# Altium project SixDOFManipulatorControllerWithRaspberryPiPicoInArduino.PrjPcb
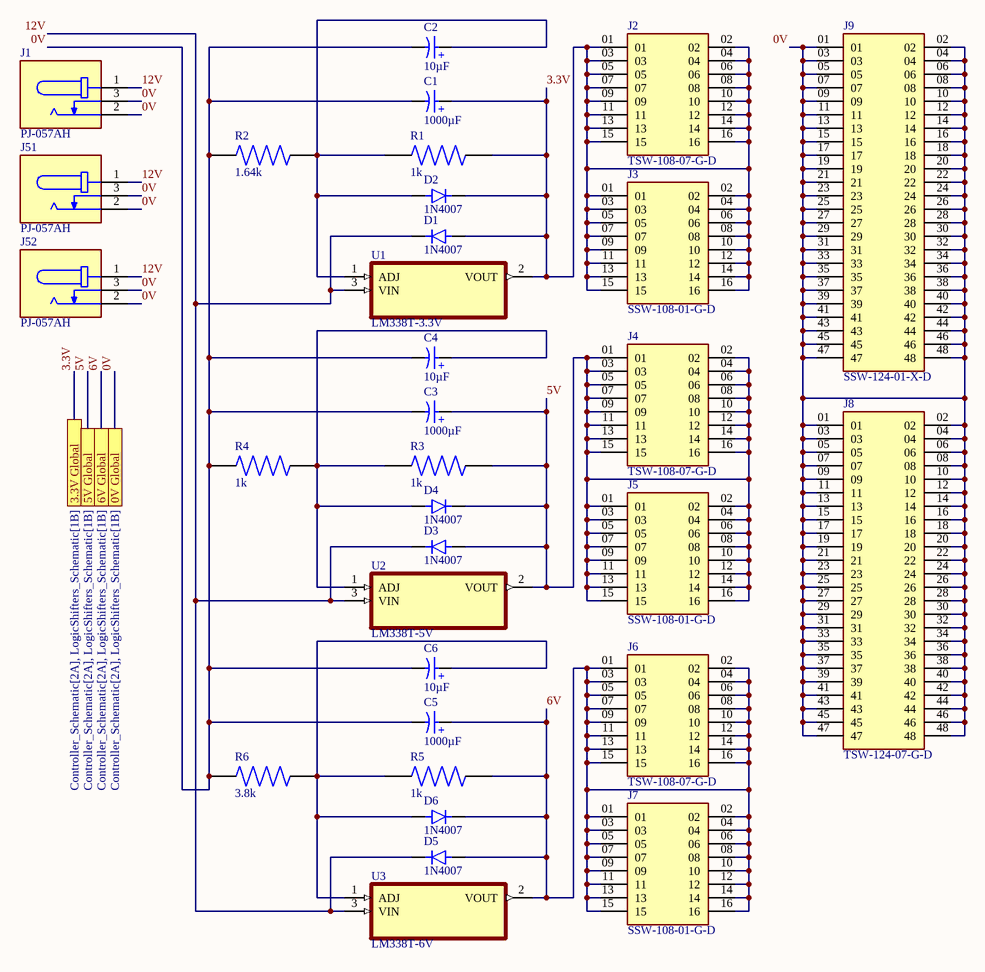
[diagram p0: PowerSupply_Schematic.SchDoc]
3 sheets, 135 parts. Net scope: flat (ports and power ports of the same name join across sheets).
Board file: PCB.PcbDoc
Sheets:
  PowerSupply_Schematic.SchDoc
  LogicShifters_Schematic.SchDoc
  Controller_Schematic.SchDoc

## Sheet PowerSupply_Schematic.SchDoc
size A3; SheetNumber: 1; SheetTotal: 3; SPICEModelCacheCBIUOFXF: <root> / <DocumentId>CBIUOFXF</DocumentId> / <CacheFrame Number="0"> / <Model Name="860020375017_1mf" Kind="CKT"> / <Text>******* / .subckt 860020375017_1mF 1 2 / Rser 1 3 0.071 / Lser 2 4 0.0000000243 / C1 3 4 0.001 / Rpar 3 4 100000 / .ends 860020375017_1mF</Text> / </Model> / <Model Name="860020372001_10uf" Kind="CKT"> / <Text>******* / .subckt 860020372001_10uF 1 2 / Rser 1 3 1.95182658193 / Lser 2 4 4.159236184E-09 / C1 3 4 0.00001 / Rpar 3 4 5333333.33333333 / .ends 860020372001_10uF</Text> / </Model> / </CacheFrame> / </root>

### Parts
C1  1000µF  [WCAP-ATG5_D10H12.5]
C2  10µF  [WCAP-ATG5_D5H11]
C3  1000µF  [WCAP-ATG5_D10H12.5]
C4  10µF  [WCAP-ATG5_D5H11]
C5  1000µF  [WCAP-ATG5_D10H12.5]
C6  10µF  [WCAP-ATG5_D5H11]
D1  1N4007  [DIOAD1060W80L520D270]
D2  1N4007  [DIOAD1060W80L520D270]
D3  1N4007  [DIOAD1060W80L520D270]
D4  1N4007  [DIOAD1060W80L520D270]
D5  1N4007  [DIOAD1060W80L520D270]
D6  1N4007  [DIOAD1060W80L520D270]
J1  PJ-057AH  [CUI_PJ-057AH]
J2  TSW-108-07-G-D  [SAMTEC_TSW-108-07-G-D]
J3  SSW-108-01-G-D  [SAMTEC_SSW-108-01-G-D]
J4  TSW-108-07-G-D  [SAMTEC_TSW-108-07-G-D]
J5  SSW-108-01-G-D  [SAMTEC_SSW-108-01-G-D]
J6  TSW-108-07-G-D  [SAMTEC_TSW-108-07-G-D]
J7  SSW-108-01-G-D  [SAMTEC_SSW-108-01-G-D]
J8  TSW-124-07-G-D  [SAMTEC_TSW-124-07-G-D]
J9  SSW-124-01-X-D  [SAMTEC_SSW-124-01-X-D]
J51  PJ-057AH  [CUI_PJ-057AH]
J52  PJ-057AH  [CUI_PJ-057AH]
R1  1k  [RESAD700W45L350D185]
R2  1.64k  [RESAD700W45L350D185]
R3  1k  [RESAD700W45L350D185]
R4  1k  [RESAD700W45L350D185]
R5  1k  [RESAD700W45L350D185]
R6  3.8k  [RESAD700W45L350D185]
U1  LM338T-3.3V  [TO254P1054X470X1955-3]
U2  LM338T-5V  [TO254P1054X470X1955-3]
U3  LM338T-6V  [TO254P1054X470X1955-3]

### Ports
0V Global (see Controller_Schematic[2A], LogicShifters_Schematic[1B]), 3.3V Global (see Controller_Schematic[2A], LogicShifters_Schematic[1B]), 5V Global (see Controller_Schematic[2A], LogicShifters_Schematic[1B]), 6V Global (see Controller_Schematic[2A], LogicShifters_Schematic[1B])

### Nets
0V: C1.2(N) C2.2(N) C3.2(N) C4.2(N) C5.2(N) C6.2(N) J1.2 J1.3 J8.01 J8.02 J8.03 J8.04 J8.05 J8.06 J8.07 J8.08 J8.09 J8.10 J8.11 J8.12 J8.13 J8.14 J8.15 J8.16 J8.17 J8.18 J8.19 J8.20 J8.21 J8.22 J8.23 J8.24 J8.25 J8.26 J8.27 J8.28 J8.29 J8.30 J8.31 J8.32 J8.33 J8.34 J8.35 J8.36 J8.37 J8.38 J8.39 J8.40 J8.41 J8.42 J8.43 J8.44 J8.45 J8.46 J8.47 J8.48 J9.01 J9.02 J9.03 J9.04 J9.05 J9.06 J9.07 J9.08 J9.09 J9.10 J9.11 J9.12 J9.13 J9.14 J9.15 J9.16 J9.17 J9.18 J9.19 J9.20 J9.21 J9.22 J9.23 J9.24 J9.25 J9.26 J9.27 J9.28 J9.29 J9.30 J9.31 J9.32 J9.33 J9.34 J9.35 J9.36 J9.37 J9.38 J9.39 J9.40 J9.41 J9.42 J9.43 J9.44 J9.45 J9.46 J9.47 J9.48 J51.2 J51.3 J52.2 J52.3 R2.1 R4.1 R6.1 ; port 0V Global
3.3V: C1.1(P) D1.A D2.C J2.01 J2.02 J2.03 J2.04 J2.05 J2.06 J2.07 J2.08 J2.09 J2.10 J2.11 J2.12 J2.13 J2.14 J2.15 J2.16 J3.01 J3.02 J3.03 J3.04 J3.05 J3.06 J3.07 J3.08 J3.09 J3.10 J3.11 J3.12 J3.13 J3.14 J3.15 J3.16 R1.2 U1.2(VOUT) ; port 3.3V Global
5V: C3.1(P) D3.A D4.C J4.01 J4.02 J4.03 J4.04 J4.05 J4.06 J4.07 J4.08 J4.09 J4.10 J4.11 J4.12 J4.13 J4.14 J4.15 J4.16 J5.01 J5.02 J5.03 J5.04 J5.05 J5.06 J5.07 J5.08 J5.09 J5.10 J5.11 J5.12 J5.13 J5.14 J5.15 J5.16 R3.2 U2.2(VOUT) ; port 5V Global
6V: C5.1(P) D5.A D6.C J6.01 J6.02 J6.03 J6.04 J6.05 J6.06 J6.07 J6.08 J6.09 J6.10 J6.11 J6.12 J6.13 J6.14 J6.15 J6.16 J7.01 J7.02 J7.03 J7.04 J7.05 J7.06 J7.07 J7.08 J7.09 J7.10 J7.11 J7.12 J7.13 J7.14 J7.15 J7.16 R5.2 U3.2(VOUT) ; port 6V Global
12V: D1.C D3.C D5.C J1.1 J51.1 J52.1 U1.3(VIN) U2.3(VIN) U3.3(VIN)
NetC2_1: C2.1(P) D2.A R1.1 R2.2 U1.1(ADJ)
NetC4_1: C4.1(P) D4.A R3.1 R4.2 U2.1(ADJ)
NetC6_1: C6.1(P) D6.A R5.1 R6.2 U3.1(ADJ)

### Notes on the sheet
- (in symbol 860020372001) +
- (in symbol 860020375017) +

### Library data of the parts
C1 C3 C5 = 860020375017: WCAP-ATG5 Aluminum Electrolytic Capacitor, Radial, THT, D10 x H12.5mm, 1000µF, 16V; Manufacturer: Wurth Elektronik; Capacitance Tolerance: +/-20%; Dissipation Factor: 15%; Endurance: 2000h; Leakage Current: 160µA; Ripple Current: 540mA; Technical Reference: ATDF125102M016DSPA9B000; Manufacturer Part Number: 860020375017; Category: Aluminum Electrolytic Capacitors; Match Code: WCAP-ATG5; ComponentLink1Description: Website Link; ComponentLink1URL: https://www.we-online.com/redexpert/article/860020375017?ad; ComponentLink2Description: Datasheet Link; ComponentLink2URL: https://www.we-online.com/redexpert/spec/860020375017?ad; Mount: Through Hole; Operating Temperature Max: 105°C; Operating Temperature Min: -40°C; Packaging: Ammo Pack; Height: 12.5mm; Diameter: 10mm; Capacitance: 1000µF; Rated Voltage (DC): 16V
C2 C4 C6 = 860020372001: WCAP-ATG5 Aluminum Electrolytic Capacitor, Radial, THT, D5 x H11mm, 10µF, 16V; Manufacturer: Wurth Elektronik; Capacitance Tolerance: +/-20%; Dissipation Factor: 15%; Endurance: 2000h; Leakage Current: 3µA; Ripple Current: 35mA; Technical Reference: ATDC110100M016DSPA3B000; Manufacturer Part Number: 860020372001; Category: Aluminum Electrolytic Capacitors; Match Code: WCAP-ATG5; ComponentLink1Description: Website Link; ComponentLink1URL: https://www.we-online.com/redexpert/article/860020372001?ad; ComponentLink2Description: Datasheet Link; ComponentLink2URL: https://www.we-online.com/redexpert/spec/860020372001?ad; Mount: Through Hole; Operating Temperature Max: 105°C; Operating Temperature Min: -40°C; Packaging: Ammo Pack; Height: 11mm; Diameter: 5mm; Capacitance: 10µF; Rated Voltage (DC): 16V
D1-D6 = 1N4007: Rectifier Silicon, 1000V, 1 A, DO-41 Case, Solder Leads, 1N Series | NTE Electronics Inc. 1N4007; MF: NTE Electronics, Inc.; SnapEDA_Link: https://www.snapeda.com/parts/1N4007/NTE+Electronics/view-part/?ref=snap; Package: DO-41 NTE Electronics; Value: *; MP: 1N4007; Check_prices: https://www.snapeda.com/parts/1N4007/NTE+Electronics/view-part/?ref=eda
J1 J51 J52 = PJ-057AH: 2.0 x 6.3 mm, 5.0 A, Horizontal, Through Hole, Pick-n-Place Top, Dc Power Jack Connector; MF: Same Sky; SnapEDA_Link: https://www.snapeda.com/parts/PJ-057AH/Same+Sky/view-part/?ref=snap; Package: None; Value: *; MP: PJ-057AH; Check_prices: https://www.snapeda.com/parts/PJ-057AH/Same+Sky/view-part/?ref=eda
J2 J4 J6 = TSW-108-07-G-D: MF: Samtec; MP: TSW-108-07-G-D; Price: None; Package: None; Value: *; Availability: Unavailable
J3 J5 J7 = SSW-108-01-G-D: MF: Samtec; Package: None; Price: None; Value: *; MP: SSW-108-01-G-D; Availability: Unavailable
J8 = TSW-124-07-G-D: MF: Samtec; Price: None; Value: *; MP: TSW-124-07-G-D; Package: None; Availability: Unavailable
J9 = SSW-124-01-X-D: MF: Samtec; Package: None; Price: None; Value: *; MP: SSW-124-01-X-D; Availability: Unavailable
R1-R6 = 3-1623927-1: 1 MOhms Â±5% 0.25W, 1/4W Through Hole Resistor Axial - Carbon Film; MF: TE Connectivity; SnapEDA_Link: https://www.snapeda.com/parts/3-1623927-1/TE+Connectivity/view-part/?ref=snap; Package: None; Value: *; MP: 3-1623927-1; Check_prices: https://www.snapeda.com/parts/3-1623927-1/TE+Connectivity/view-part/?ref=eda
U1-U3 = LM338T: 5-A, 40-V, low-IQ, adjustable linear voltage regulator 3-TO-220 0 to 125; MF: Texas Instruments; SnapEDA_Link: https://www.snapeda.com/parts/LM338T/Texas+Instruments/view-part/?ref=snap; Package: TO-220-3 Texas Instruments; Value: *; MP: LM338T; Check_prices: https://www.snapeda.com/parts/LM338T/Texas+Instruments/view-part/?ref=eda

## Sheet LogicShifters_Schematic.SchDoc
size A3; SheetNumber: 2; SheetTotal: 3
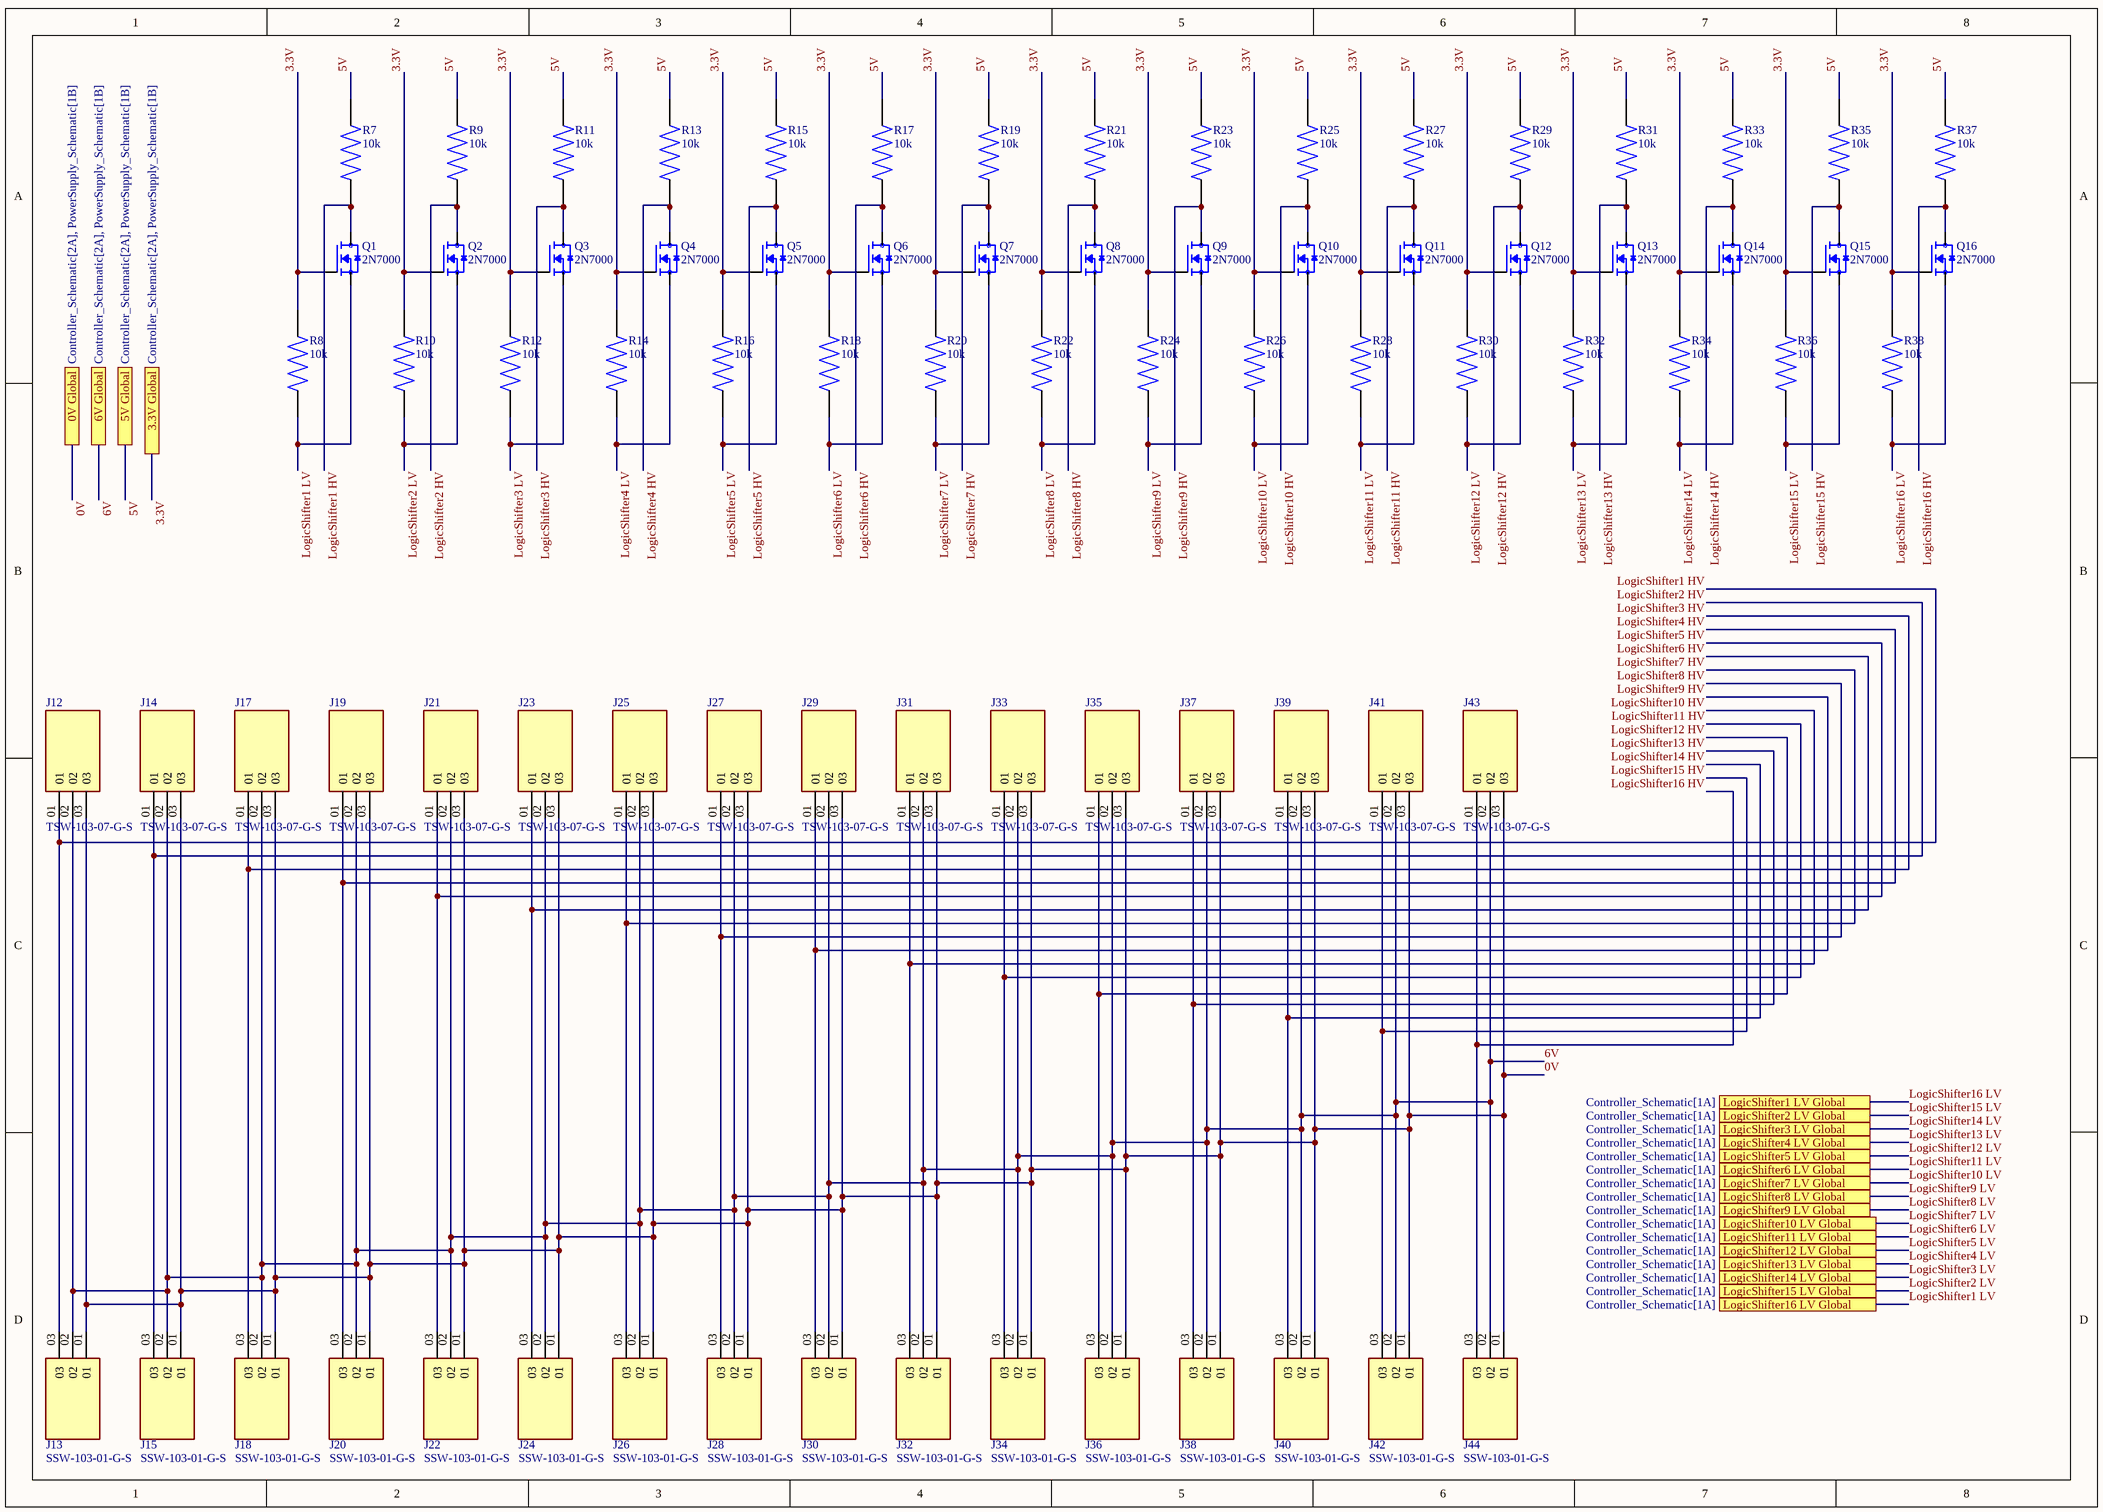
[diagram p1: LogicShifters_Schematic.SchDoc]

### Parts
J12  TSW-103-07-G-S  [SAMTEC_TSW-103-07-G-S]
J13  SSW-103-01-G-S  [SAMTEC_SSW-103-01-G-S]
J14  TSW-103-07-G-S  [SAMTEC_TSW-103-07-G-S]
J15  SSW-103-01-G-S  [SAMTEC_SSW-103-01-G-S]
J17  TSW-103-07-G-S  [SAMTEC_TSW-103-07-G-S]
J18  SSW-103-01-G-S  [SAMTEC_SSW-103-01-G-S]
J19  TSW-103-07-G-S  [SAMTEC_TSW-103-07-G-S]
J20  SSW-103-01-G-S  [SAMTEC_SSW-103-01-G-S]
J21  TSW-103-07-G-S  [SAMTEC_TSW-103-07-G-S]
J22  SSW-103-01-G-S  [SAMTEC_SSW-103-01-G-S]
J23  TSW-103-07-G-S  [SAMTEC_TSW-103-07-G-S]
J24  SSW-103-01-G-S  [SAMTEC_SSW-103-01-G-S]
J25  TSW-103-07-G-S  [SAMTEC_TSW-103-07-G-S]
J26  SSW-103-01-G-S  [SAMTEC_SSW-103-01-G-S]
J27  TSW-103-07-G-S  [SAMTEC_TSW-103-07-G-S]
J28  SSW-103-01-G-S  [SAMTEC_SSW-103-01-G-S]
J29  TSW-103-07-G-S  [SAMTEC_TSW-103-07-G-S]
J30  SSW-103-01-G-S  [SAMTEC_SSW-103-01-G-S]
J31  TSW-103-07-G-S  [SAMTEC_TSW-103-07-G-S]
J32  SSW-103-01-G-S  [SAMTEC_SSW-103-01-G-S]
J33  TSW-103-07-G-S  [SAMTEC_TSW-103-07-G-S]
J34  SSW-103-01-G-S  [SAMTEC_SSW-103-01-G-S]
J35  TSW-103-07-G-S  [SAMTEC_TSW-103-07-G-S]
J36  SSW-103-01-G-S  [SAMTEC_SSW-103-01-G-S]
J37  TSW-103-07-G-S  [SAMTEC_TSW-103-07-G-S]
J38  SSW-103-01-G-S  [SAMTEC_SSW-103-01-G-S]
J39  TSW-103-07-G-S  [SAMTEC_TSW-103-07-G-S]
J40  SSW-103-01-G-S  [SAMTEC_SSW-103-01-G-S]
J41  TSW-103-07-G-S  [SAMTEC_TSW-103-07-G-S]
J42  SSW-103-01-G-S  [SAMTEC_SSW-103-01-G-S]
J43  TSW-103-07-G-S  [SAMTEC_TSW-103-07-G-S]
J44  SSW-103-01-G-S  [SAMTEC_SSW-103-01-G-S]
Q1  2N7000  [TO92254P458H750-3]
Q2  2N7000  [TO92254P458H750-3]
Q3  2N7000  [TO92254P458H750-3]
Q4  2N7000  [TO92254P458H750-3]
Q5  2N7000  [TO92254P458H750-3]
Q6  2N7000  [TO92254P458H750-3]
Q7  2N7000  [TO92254P458H750-3]
Q8  2N7000  [TO92254P458H750-3]
Q9  2N7000  [TO92254P458H750-3]
Q10  2N7000  [TO92254P458H750-3]
Q11  2N7000  [TO92254P458H750-3]
Q12  2N7000  [TO92254P458H750-3]
Q13  2N7000  [TO92254P458H750-3]
Q14  2N7000  [TO92254P458H750-3]
Q15  2N7000  [TO92254P458H750-3]
Q16  2N7000  [TO92254P458H750-3]
R7  10k  [RESAD700W45L350D185]
R8  10k  [RESAD700W45L350D185]
R9  10k  [RESAD700W45L350D185]
R10  10k  [RESAD700W45L350D185]
R11  10k  [RESAD700W45L350D185]
R12  10k  [RESAD700W45L350D185]
R13  10k  [RESAD700W45L350D185]
R14  10k  [RESAD700W45L350D185]
R15  10k  [RESAD700W45L350D185]
R16  10k  [RESAD700W45L350D185]
R17  10k  [RESAD700W45L350D185]
R18  10k  [RESAD700W45L350D185]
R19  10k  [RESAD700W45L350D185]
R20  10k  [RESAD700W45L350D185]
R21  10k  [RESAD700W45L350D185]
R22  10k  [RESAD700W45L350D185]
R23  10k  [RESAD700W45L350D185]
R24  10k  [RESAD700W45L350D185]
R25  10k  [RESAD700W45L350D185]
R26  10k  [RESAD700W45L350D185]
R27  10k  [RESAD700W45L350D185]
R28  10k  [RESAD700W45L350D185]
R29  10k  [RESAD700W45L350D185]
R30  10k  [RESAD700W45L350D185]
R31  10k  [RESAD700W45L350D185]
R32  10k  [RESAD700W45L350D185]
R33  10k  [RESAD700W45L350D185]
R34  10k  [RESAD700W45L350D185]
R35  10k  [RESAD700W45L350D185]
R36  10k  [RESAD700W45L350D185]
R37  10k  [RESAD700W45L350D185]
R38  10k  [RESAD700W45L350D185]

### Ports
0V Global (see Controller_Schematic[2A], PowerSupply_Schematic[1B]), 3.3V Global (see Controller_Schematic[2A], PowerSupply_Schematic[1B]), 5V Global (see Controller_Schematic[2A], PowerSupply_Schematic[1B]), 6V Global (see Controller_Schematic[2A], PowerSupply_Schematic[1B]), LogicShifter1 LV Global (see Controller_Schematic[1A]), LogicShifter2 LV Global (see Controller_Schematic[1A]), LogicShifter3 LV Global (see Controller_Schematic[1A]), LogicShifter4 LV Global (see Controller_Schematic[1A]), LogicShifter5 LV Global (see Controller_Schematic[1A]), LogicShifter6 LV Global (see Controller_Schematic[1A]), LogicShifter7 LV Global (see Controller_Schematic[1A]), LogicShifter8 LV Global (see Controller_Schematic[1A]), LogicShifter9 LV Global (see Controller_Schematic[1A]), LogicShifter10 LV Global (see Controller_Schematic[1A]), LogicShifter11 LV Global (see Controller_Schematic[1A]), LogicShifter12 LV Global (see Controller_Schematic[1A]), LogicShifter13 LV Global (see Controller_Schematic[1A]), LogicShifter14 LV Global (see Controller_Schematic[1A]), LogicShifter15 LV Global (see Controller_Schematic[1A]), LogicShifter16 LV Global (see Controller_Schematic[1A])

### Nets
0V: J12.03 J13.01 J14.03 J15.01 J17.03 J18.01 J19.03 J20.01 J21.03 J22.01 J23.03 J24.01 J25.03 J26.01 J27.03 J28.01 J29.03 J30.01 J31.03 J32.01 J33.03 J34.01 J35.03 J36.01 J37.03 J38.01 J39.03 J40.01 J41.03 J42.01 J43.03 J44.01 ; port 0V Global
3.3V: Q1.2(G) Q2.2(G) Q3.2(G) Q4.2(G) Q5.2(G) Q6.2(G) Q7.2(G) Q8.2(G) Q9.2(G) Q10.2(G) Q11.2(G) Q12.2(G) Q13.2(G) Q14.2(G) Q15.2(G) Q16.2(G) R8.2 R10.2 R12.2 R14.2 R16.2 R18.2 R20.2 R22.2 R24.2 R26.2 R28.2 R30.2 R32.2 R34.2 R36.2 R38.2 ; port 3.3V Global
5V: R7.2 R9.2 R11.2 R13.2 R15.2 R17.2 R19.2 R21.2 R23.2 R25.2 R27.2 R29.2 R31.2 R33.2 R35.2 R37.2 ; port 5V Global
6V: J12.02 J13.02 J14.02 J15.02 J17.02 J18.02 J19.02 J20.02 J21.02 J22.02 J23.02 J24.02 J25.02 J26.02 J27.02 J28.02 J29.02 J30.02 J31.02 J32.02 J33.02 J34.02 J35.02 J36.02 J37.02 J38.02 J39.02 J40.02 J41.02 J42.02 J43.02 J44.02 ; port 6V Global
LogicShifter1 HV: J12.01 J13.03 Q1.3(D) R7.1
LogicShifter1 LV: Q1.1(S) R8.1 ; port LogicShifter16 LV Global
LogicShifter2 HV: J14.01 J15.03 Q2.3(D) R9.1
LogicShifter2 LV: Q2.1(S) R10.1 ; port LogicShifter15 LV Global
LogicShifter3 HV: J17.01 J18.03 Q3.3(D) R11.1
LogicShifter3 LV: Q3.1(S) R12.1 ; port LogicShifter14 LV Global
LogicShifter4 HV: J19.01 J20.03 Q4.3(D) R13.1
LogicShifter4 LV: Q4.1(S) R14.1 ; port LogicShifter13 LV Global
LogicShifter5 HV: J21.01 J22.03 Q5.3(D) R15.1
LogicShifter5 LV: Q5.1(S) R16.1 ; port LogicShifter12 LV Global
LogicShifter6 HV: J23.01 J24.03 Q6.3(D) R17.1
LogicShifter6 LV: Q6.1(S) R18.1 ; port LogicShifter11 LV Global
LogicShifter7 HV: J25.01 J26.03 Q7.3(D) R19.1
LogicShifter7 LV: Q7.1(S) R20.1 ; port LogicShifter10 LV Global
LogicShifter8 HV: J27.01 J28.03 Q8.3(D) R21.1
LogicShifter8 LV: Q8.1(S) R22.1 ; port LogicShifter9 LV Global
LogicShifter9 HV: J29.01 J30.03 Q9.3(D) R23.1
LogicShifter9 LV: Q9.1(S) R24.1 ; port LogicShifter8 LV Global
LogicShifter10 HV: J31.01 J32.03 Q10.3(D) R25.1
LogicShifter10 LV: Q10.1(S) R26.1 ; port LogicShifter7 LV Global
LogicShifter11 HV: J33.01 J34.03 Q11.3(D) R27.1
LogicShifter11 LV: Q11.1(S) R28.1 ; port LogicShifter6 LV Global
LogicShifter12 HV: J35.01 J36.03 Q12.3(D) R29.1
LogicShifter12 LV: Q12.1(S) R30.1 ; port LogicShifter5 LV Global
LogicShifter13 HV: J37.01 J38.03 Q13.3(D) R31.1
LogicShifter13 LV: Q13.1(S) R32.1 ; port LogicShifter4 LV Global
LogicShifter14 HV: J39.01 J40.03 Q14.3(D) R33.1
LogicShifter14 LV: Q14.1(S) R34.1 ; port LogicShifter3 LV Global
LogicShifter15 HV: J41.01 J42.03 Q15.3(D) R35.1
LogicShifter15 LV: Q15.1(S) R36.1 ; port LogicShifter2 LV Global
LogicShifter16 HV: J43.01 J44.03 Q16.3(D) R37.1
LogicShifter16 LV: Q16.1(S) R38.1 ; port LogicShifter1 LV Global

### Library data of the parts
J12 J14 J17 J19 J21 J23 J25 J27 J29 J31 J33 J35 J37 J39 J41 J43 = TSW-103-07-G-S: MF: Samtec; Value: *; Availability: Unavailable; Price: None; Package: None; MP: TSW-103-07-G-S
J13 J15 J18 J20 J22 J24 J26 J28 J30 J32 J34 J36 J38 J40 J42 J44 = SSW-103-01-G-S: MF: Samtec; Availability: Unavailable; Value: *; MP: SSW-103-01-G-S; Package: None; Price: None
Q1-Q16 = 2N7000: N-Channel 60 V 200mA (Ta) Through Hole TO-92; MF: NTE Electronics, Inc.; SnapEDA_Link: https://www.snapeda.com/parts/2N7000/NTE+Electronics/view-part/?ref=snap; Package: TO-226-3 NTE Electronics, Inc.; Value: *; MP: 2N7000; Check_prices: https://www.snapeda.com/parts/2N7000/NTE+Electronics/view-part/?ref=eda
R7-R38 = 3-1623927-1: as R1 on sheet PowerSupply_Schematic; SnapEDA_Link: https://www.snapeda.com/parts/3-1623927-1/TE+Connectivity/view-part/?ref=snap; Package: None; Value: *; MP: 3-1623927-1; Check_prices: https://www.snapeda.com/parts/3-1623927-1/TE+Connectivity/view-part/?ref=eda

## Sheet Controller_Schematic.SchDoc
size A3; SheetNumber: 3; SheetTotal: 3
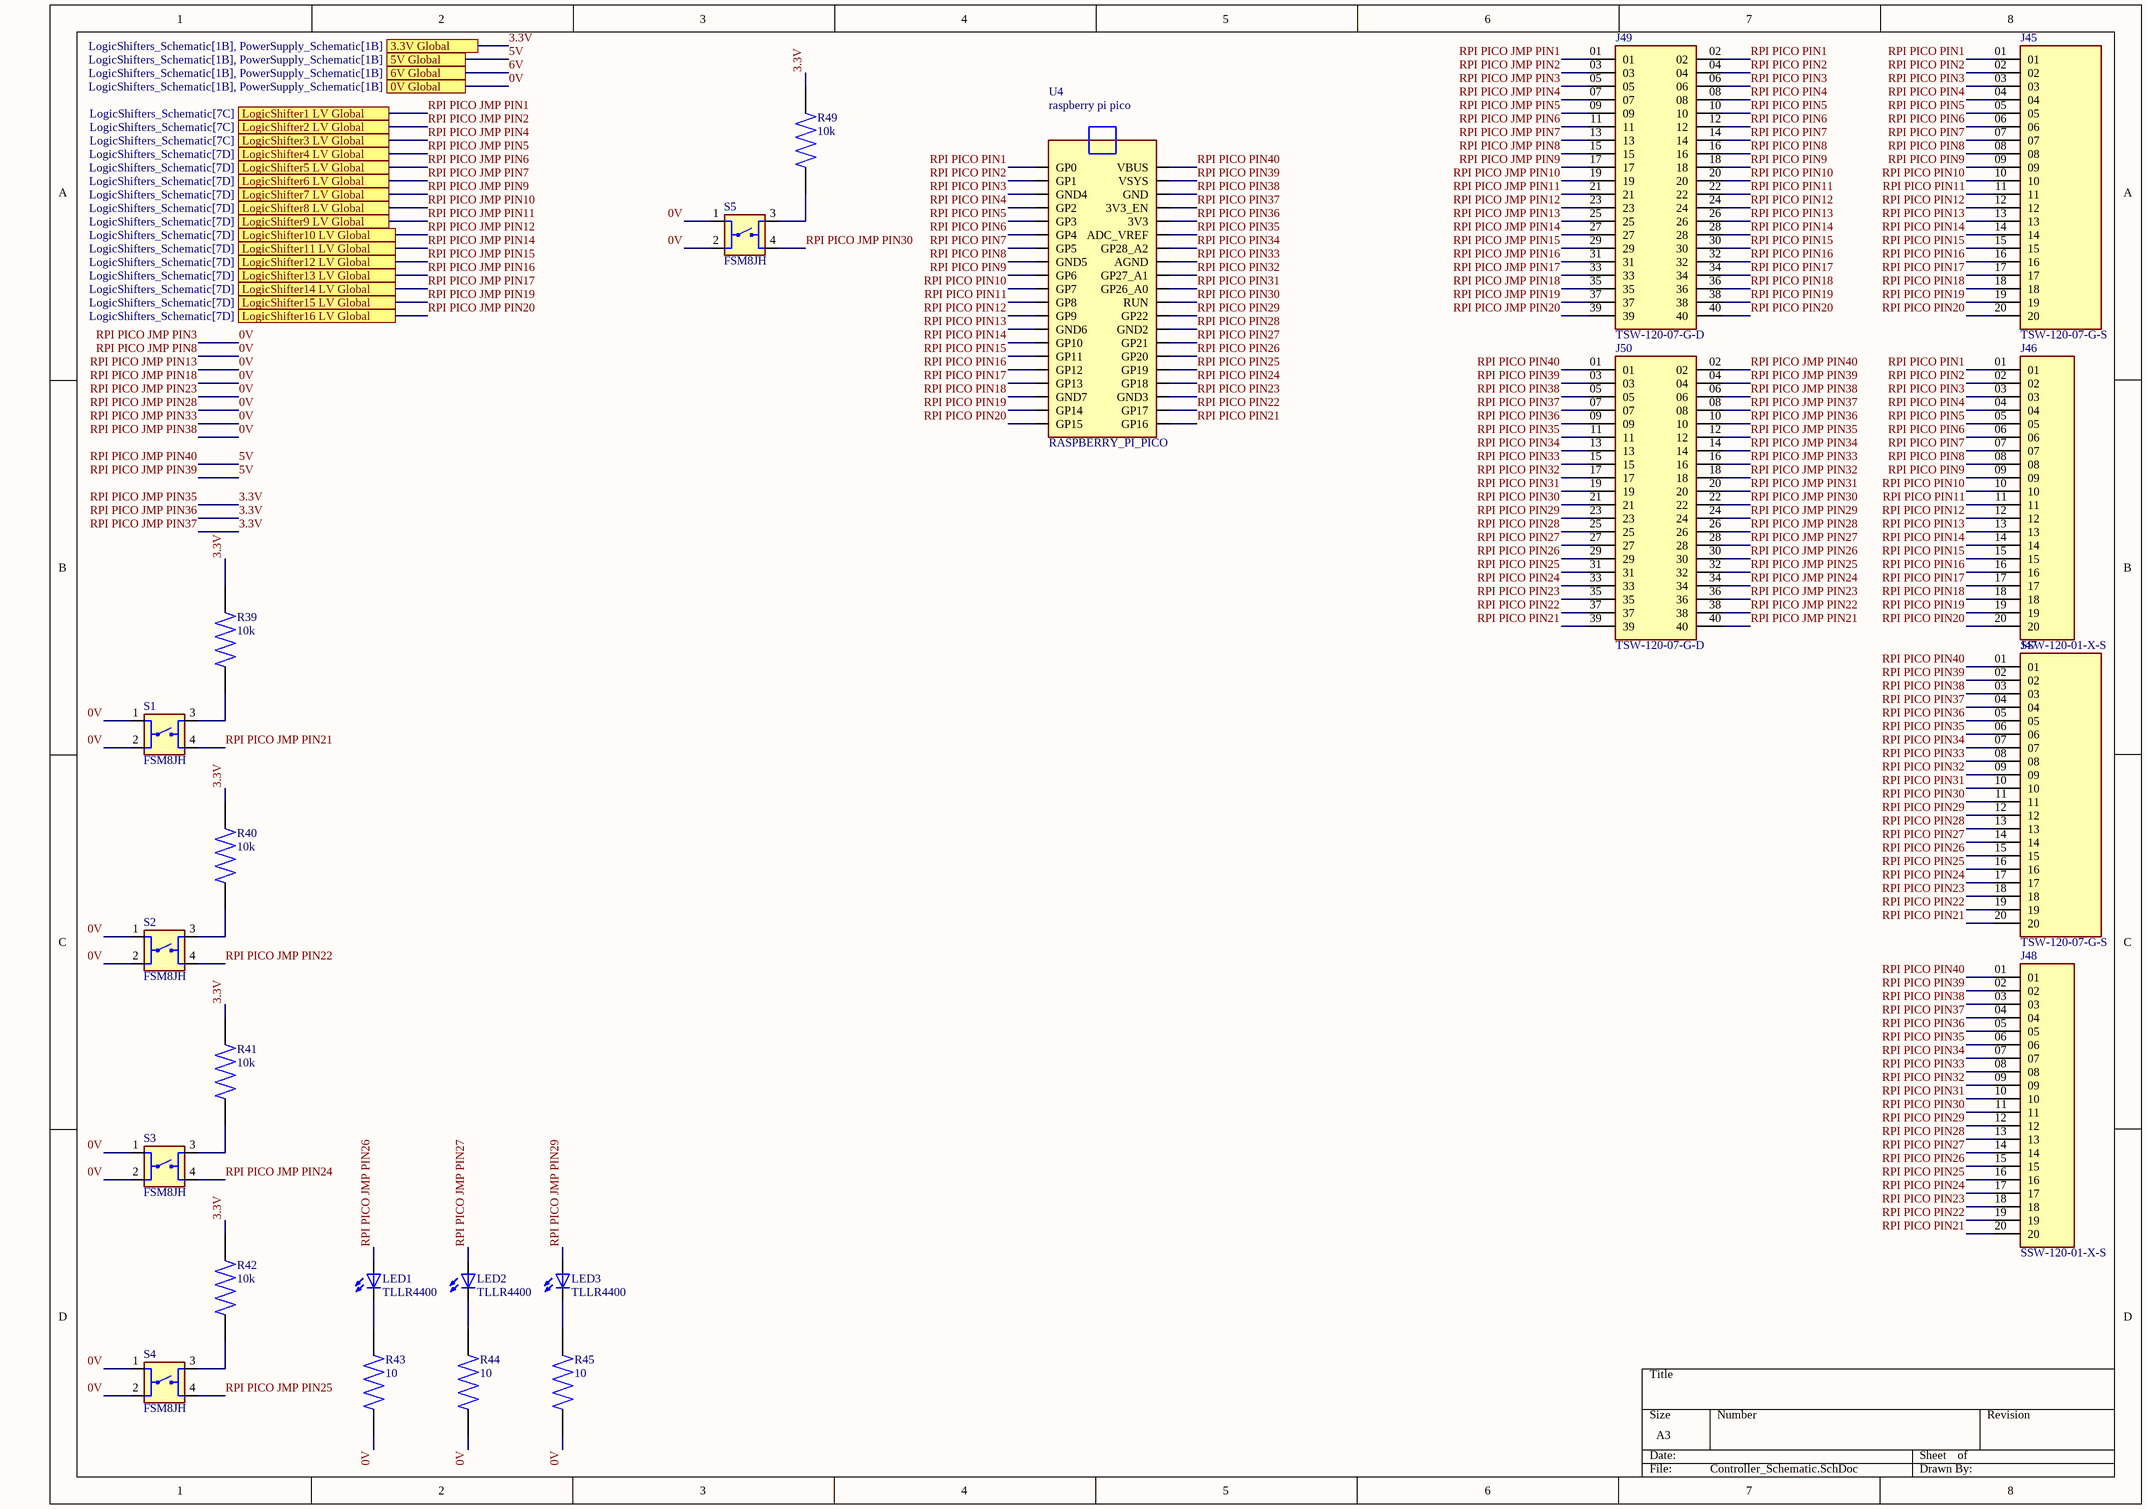
[diagram p2: Controller_Schematic.SchDoc]

### Parts
J45  TSW-120-07-G-S  [SAMTEC_TSW-120-07-G-S]
J46  SSW-120-01-X-S  [SAMTEC_SSW-120-01-X-S]
J47  TSW-120-07-G-S  [SAMTEC_TSW-120-07-G-S]
J48  SSW-120-01-X-S  [SAMTEC_SSW-120-01-X-S]
J49  TSW-120-07-G-D  [SAMTEC_TSW-120-07-G-D]
J50  TSW-120-07-G-D  [SAMTEC_TSW-120-07-G-D]
LED1  TLLR4400  [LED3MM]
LED2  TLLR4400  [LED3MM]
LED3  TLLR4400  [LED3MM]
R39  10k  [RESAD700W45L350D185]
R40  10k  [RESAD700W45L350D185]
R41  10k  [RESAD700W45L350D185]
R42  10k  [RESAD700W45L350D185]
R43  10  [RESAD700W45L350D185]
R44  10  [RESAD700W45L350D185]
R45  10  [RESAD700W45L350D185]
R49  10k  [RESAD700W45L350D185]
S1  FSM8JH  [SW_FSM8JH]
S2  FSM8JH  [SW_FSM8JH]
S3  FSM8JH  [SW_FSM8JH]
S4  FSM8JH  [SW_FSM8JH]
S5  FSM8JH  [SW_FSM8JH]
U4  RASPBERRY_PI_PICO  [RASPBERRY_PI_PICO]

### Ports
0V Global (see LogicShifters_Schematic[1B], PowerSupply_Schematic[1B]), 3.3V Global (see LogicShifters_Schematic[1B], PowerSupply_Schematic[1B]), 5V Global (see LogicShifters_Schematic[1B], PowerSupply_Schematic[1B]), 6V Global (see LogicShifters_Schematic[1B], PowerSupply_Schematic[1B]), LogicShifter1 LV Global (see LogicShifters_Schematic[7C]), LogicShifter2 LV Global (see LogicShifters_Schematic[7C]), LogicShifter3 LV Global (see LogicShifters_Schematic[7C]), LogicShifter4 LV Global (see LogicShifters_Schematic[7D]), LogicShifter5 LV Global (see LogicShifters_Schematic[7D]), LogicShifter6 LV Global (see LogicShifters_Schematic[7D]), LogicShifter7 LV Global (see LogicShifters_Schematic[7D]), LogicShifter8 LV Global (see LogicShifters_Schematic[7D]), LogicShifter9 LV Global (see LogicShifters_Schematic[7D]), LogicShifter10 LV Global (see LogicShifters_Schematic[7D]), LogicShifter11 LV Global (see LogicShifters_Schematic[7D]), LogicShifter12 LV Global (see LogicShifters_Schematic[7D]), LogicShifter13 LV Global (see LogicShifters_Schematic[7D]), LogicShifter14 LV Global (see LogicShifters_Schematic[7D]), LogicShifter15 LV Global (see LogicShifters_Schematic[7D]), LogicShifter16 LV Global (see LogicShifters_Schematic[7D])

### Nets
0V: J49.05 J49.15 J49.25 J49.35 J50.06 J50.16 J50.26 J50.36 R43.1 R44.1 R45.1 S1.1 S1.2 S2.1 S2.2 S3.1 S3.2 S4.1 S4.2 S5.1 S5.2 ; port 0V Global  [also labelled RPI PICO JMP PIN13, RPI PICO JMP PIN18, RPI PICO JMP PIN23, RPI PICO JMP PIN28, RPI PICO JMP PIN3, RPI PICO JMP PIN33, RPI PICO JMP PIN38, RPI PICO JMP PIN8]
3.3V: J50.08 J50.10 J50.12 R39.2 R40.2 R41.2 R42.2 R49.2 ; port 3.3V Global  [also labelled RPI PICO JMP PIN35, RPI PICO JMP PIN36, RPI PICO JMP PIN37]
5V: J50.02 J50.04 ; port 5V Global  [also labelled RPI PICO JMP PIN39, RPI PICO JMP PIN40]
RPI PICO JMP PIN1: J49.01 ; port LogicShifter1 LV Global  [project net LogicShifter16 LV]
RPI PICO JMP PIN2: J49.03 ; port LogicShifter2 LV Global  [project net LogicShifter15 LV]
RPI PICO JMP PIN4: J49.07 ; port LogicShifter3 LV Global  [project net LogicShifter14 LV]
RPI PICO JMP PIN5: J49.09 ; port LogicShifter4 LV Global  [project net LogicShifter13 LV]
RPI PICO JMP PIN6: J49.11 ; port LogicShifter5 LV Global  [project net LogicShifter12 LV]
RPI PICO JMP PIN7: J49.13 ; port LogicShifter6 LV Global  [project net LogicShifter11 LV]
RPI PICO JMP PIN9: J49.17 ; port LogicShifter7 LV Global  [project net LogicShifter10 LV]
RPI PICO JMP PIN10: J49.19 ; port LogicShifter8 LV Global  [project net LogicShifter9 LV]
RPI PICO JMP PIN11: J49.21 ; port LogicShifter9 LV Global  [project net LogicShifter8 LV]
RPI PICO JMP PIN12: J49.23 ; port LogicShifter10 LV Global  [project net LogicShifter7 LV]
RPI PICO JMP PIN14: J49.27 ; port LogicShifter11 LV Global  [project net LogicShifter6 LV]
RPI PICO JMP PIN15: J49.29 ; port LogicShifter12 LV Global  [project net LogicShifter5 LV]
RPI PICO JMP PIN16: J49.31 ; port LogicShifter13 LV Global  [project net LogicShifter4 LV]
RPI PICO JMP PIN17: J49.33 ; port LogicShifter14 LV Global  [project net LogicShifter3 LV]
RPI PICO JMP PIN19: J49.37 ; port LogicShifter15 LV Global  [project net LogicShifter2 LV]
RPI PICO JMP PIN20: J49.39 ; port LogicShifter16 LV Global  [project net LogicShifter1 LV]
RPI PICO JMP PIN21: J50.40 S1.4
RPI PICO JMP PIN22: J50.38 S2.4
RPI PICO JMP PIN24: J50.34 S3.4
RPI PICO JMP PIN25: J50.32 S4.4
RPI PICO JMP PIN26: J50.30 LED1.A
RPI PICO JMP PIN27: J50.28 LED2.A
RPI PICO JMP PIN29: J50.24 LED3.A
RPI PICO JMP PIN30: J50.22 S5.4
RPI PICO JMP PIN31: J50.20
RPI PICO JMP PIN32: J50.18
RPI PICO JMP PIN34: J50.14
RPI PICO PIN1: J45.01 J46.01 J49.02 U4.GP0
RPI PICO PIN2: J45.02 J46.02 J49.04 U4.GP1
RPI PICO PIN3: J45.03 J46.03 J49.06 U4.GND4
RPI PICO PIN4: J45.04 J46.04 J49.08 U4.GP2
RPI PICO PIN5: J45.05 J46.05 J49.10 U4.GP3
RPI PICO PIN6: J45.06 J46.06 J49.12 U4.GP4
RPI PICO PIN7: J45.07 J46.07 J49.14 U4.GP5
RPI PICO PIN8: J45.08 J46.08 J49.16 U4.GND5
RPI PICO PIN9: J45.09 J46.09 J49.18 U4.GP6
RPI PICO PIN10: J45.10 J46.10 J49.20 U4.GP7
RPI PICO PIN11: J45.11 J46.11 J49.22 U4.GP8
RPI PICO PIN12: J45.12 J46.12 J49.24 U4.GP9
RPI PICO PIN13: J45.13 J46.13 J49.26 U4.GND6
RPI PICO PIN14: J45.14 J46.14 J49.28 U4.GP10
RPI PICO PIN15: J45.15 J46.15 J49.30 U4.GP11
RPI PICO PIN16: J45.16 J46.16 J49.32 U4.GP12
RPI PICO PIN17: J45.17 J46.17 J49.34 U4.GP13
RPI PICO PIN18: J45.18 J46.18 J49.36 U4.GND7
RPI PICO PIN19: J45.19 J46.19 J49.38 U4.GP14
RPI PICO PIN20: J45.20 J46.20 J49.40 U4.GP15
RPI PICO PIN21: J47.20 J48.20 J50.39 U4.GP16
RPI PICO PIN22: J47.19 J48.19 J50.37 U4.GP17
RPI PICO PIN23: J47.18 J48.18 J50.35 U4.GND3
RPI PICO PIN24: J47.17 J48.17 J50.33 U4.GP18
RPI PICO PIN25: J47.16 J48.16 J50.31 U4.GP19
RPI PICO PIN26: J47.15 J48.15 J50.29 U4.GP20
RPI PICO PIN27: J47.14 J48.14 J50.27 U4.GP21
RPI PICO PIN28: J47.13 J48.13 J50.25 U4.GND2
RPI PICO PIN29: J47.12 J48.12 J50.23 U4.GP22
RPI PICO PIN30: J47.11 J48.11 J50.21 U4.RUN
RPI PICO PIN31: J47.10 J48.10 J50.19 U4.GP26_A0
RPI PICO PIN32: J47.09 J48.09 J50.17 U4.GP27_A1
RPI PICO PIN33: J47.08 J48.08 J50.15 U4.AGND
RPI PICO PIN34: J47.07 J48.07 J50.13 U4.GP28_A2
RPI PICO PIN35: J47.06 J48.06 J50.11 U4.ADC_VREF
RPI PICO PIN36: J47.05 J48.05 J50.09 U4.3V3
RPI PICO PIN37: J47.04 J48.04 J50.07 U4.3V3_EN
RPI PICO PIN38: J47.03 J48.03 J50.05 U4.GND
RPI PICO PIN39: J47.02 J48.02 J50.03 U4.VSYS
RPI PICO PIN40: J47.01 J48.01 J50.01 U4.VBUS
NetLED1_K: LED1.K(C) R43.2
NetLED2_K: LED2.K(C) R44.2
NetLED3_K: LED3.K(C) R45.2
NetR39_1: R39.1 S1.3
NetR40_1: R40.1 S2.3
NetR41_1: R41.1 S3.3
NetR42_1: R42.1 S4.3
NetR49_1: R49.1 S5.3

### Notes on the sheet
- (in symbol RASPBERRY_PI_PICO) raspberry pi pico

### Library data of the parts
J45 J47 = TSW-120-07-G-S: MF: Samtec; Package: None; MP: TSW-120-07-G-S; Price: None; Value: *; Availability: Unavailable
J46 J48 = SSW-120-01-X-S: SSW - Samtec 2.54mm Single Row Straight Socket Strip 8.5 Profile - Fast Stock; MP: SSW-120-01-G-S; SnapEDA_Link: https://www.snapeda.com/parts/SSW-120-01-G-S/Samtec/view-part/?ref=snap; Package: None; Value: *; MF: Samtec; Check_prices: https://www.snapeda.com/parts/SSW-120-01-G-S/Samtec/view-part/?ref=eda
J49 J50 = TSW-120-07-G-D: MF: Samtec; Price: None; Value: *; Availability: Unavailable; MP: TSW-120-07-G-D; Package: None
LED1-LED3 = TLLR4400: Red 619nm LED Indication - Discrete 1.9V Radial; MF: Vishay; SnapEDA_Link: https://www.snapeda.com/parts/TLLR4400/Vishay+Semiconductor+Opto+Division/view-part/?ref=snap; Package: None; Value: *; MP: TLLR4400; Check_prices: https://www.snapeda.com/parts/TLLR4400/Vishay+Semiconductor+Opto+Division/view-part/?ref=eda
R39-R45 R49 = 3-1623927-1: as R1 on sheet PowerSupply_Schematic; SnapEDA_Link: https://www.snapeda.com/parts/3-1623927-1/TE+Connectivity/view-part/?ref=snap; Package: None; Value: *; MP: 3-1623927-1; Check_prices: https://www.snapeda.com/parts/3-1623927-1/TE+Connectivity/view-part/?ref=eda
S1-S5 = FSM8JH: Tactile Switch SPST-NO Top Actuated Through Hole; MF: TE Connectivity; Check_prices: https://www.snapeda.com/parts/FSM8JH/TE+Connectivity+ALCOSWITCH+Switches/view-part/?ref=eda; Value: *; Availability: In Stock; MP: FSM8JH; Price: None; Package: None; SnapEDA_Link: https://www.snapeda.com/parts/FSM8JH/TE+Connectivity+ALCOSWITCH+Switches/view-part/?ref=snap
U4 = RASPBERRY_PI_PICO: Raspberry Pi Board, Arm Cortex-M0+; Core Architecture:Arm; Core Sub-Architecture:Cortex-M0+; Kit Contents:Raspberry Pi Pico Board; No. Of Bits:32Bit; Silicon Core Number:Rp2040; Silicon Manufacturer:Raspberry Pi |Raspberry-Pi RASPBERRY PI PICO; SnapEDA_Link: https://www.snapeda.com/parts/RASPBERRY%20PI%20PICO/Raspberry+Pi/view-part/?ref=snap; Package: None; Value: *; MF: Raspberry Pi; MP: RASPBERRY PI PICO; Check_prices: https://www.snapeda.com/parts/RASPBERRY%20PI%20PICO/Raspberry+Pi/view-part/?ref=eda

## Nets that join several sheets
0V: PowerSupply_Schematic (111 pins), LogicShifters_Schematic (32 pins), Controller_Schematic (21 pins)
3.3V: PowerSupply_Schematic (37 pins), LogicShifters_Schematic (32 pins), Controller_Schematic (8 pins)
5V: PowerSupply_Schematic (37 pins), LogicShifters_Schematic (16 pins), Controller_Schematic (J50.02 J50.04)
6V: PowerSupply_Schematic (37 pins), LogicShifters_Schematic (32 pins)
LogicShifter1 LV: LogicShifters_Schematic (Q1.1 R8.1), Controller_Schematic (J49.39)
LogicShifter2 LV: LogicShifters_Schematic (Q2.1 R10.1), Controller_Schematic (J49.37)
LogicShifter3 LV: LogicShifters_Schematic (Q3.1 R12.1), Controller_Schematic (J49.33)
LogicShifter4 LV: LogicShifters_Schematic (Q4.1 R14.1), Controller_Schematic (J49.31)
LogicShifter5 LV: LogicShifters_Schematic (Q5.1 R16.1), Controller_Schematic (J49.29)
LogicShifter6 LV: LogicShifters_Schematic (Q6.1 R18.1), Controller_Schematic (J49.27)
LogicShifter7 LV: LogicShifters_Schematic (Q7.1 R20.1), Controller_Schematic (J49.23)
LogicShifter8 LV: LogicShifters_Schematic (Q8.1 R22.1), Controller_Schematic (J49.21)
LogicShifter9 LV: LogicShifters_Schematic (Q9.1 R24.1), Controller_Schematic (J49.19)
LogicShifter10 LV: LogicShifters_Schematic (Q10.1 R26.1), Controller_Schematic (J49.17)
LogicShifter11 LV: LogicShifters_Schematic (Q11.1 R28.1), Controller_Schematic (J49.13)
LogicShifter12 LV: LogicShifters_Schematic (Q12.1 R30.1), Controller_Schematic (J49.11)
LogicShifter13 LV: LogicShifters_Schematic (Q13.1 R32.1), Controller_Schematic (J49.09)
LogicShifter14 LV: LogicShifters_Schematic (Q14.1 R34.1), Controller_Schematic (J49.07)
LogicShifter15 LV: LogicShifters_Schematic (Q15.1 R36.1), Controller_Schematic (J49.03)
LogicShifter16 LV: LogicShifters_Schematic (Q16.1 R38.1), Controller_Schematic (J49.01)